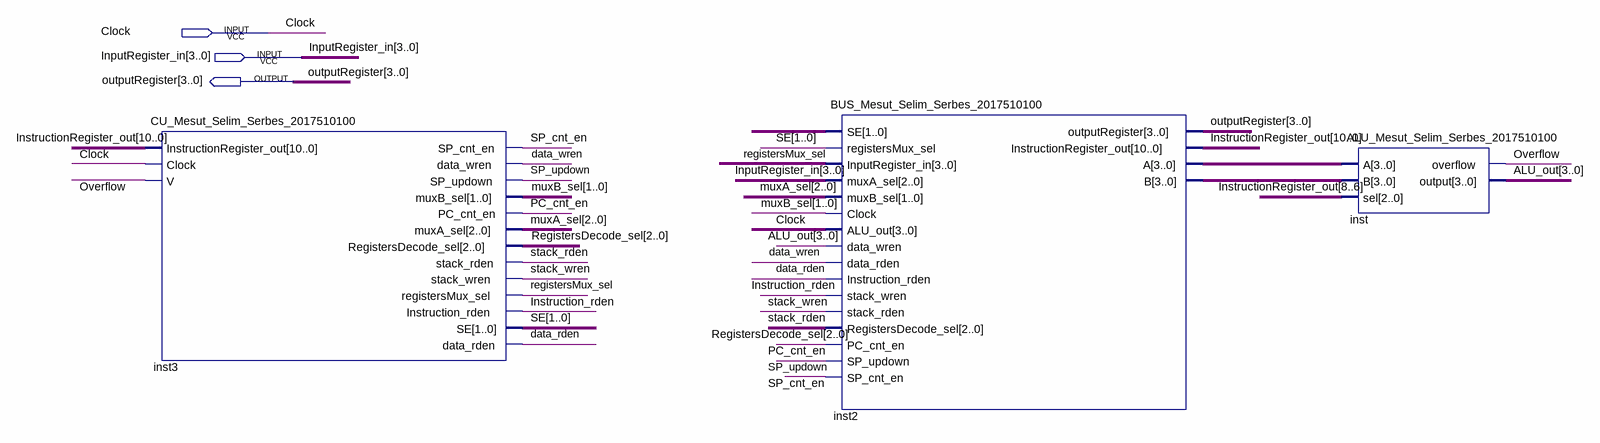
[diagram p0: schematic sheet]
// Quartus schematic DEUARC_Mesut_Selim_Serbes_2017510100.bdf as structural Verilog: 3 symbols, 3 pins
module DEUARC_Mesut_Selim_Serbes_2017510100 (
  input  Clock,
  input  [3:0] InputRegister_in,
  output [3:0] outputRegister
);

  wire data_rden, data_wren, Instruction_rden, Overflow, PC_cnt_en, registersMux_sel, SP_cnt_en, SP_updown,
       stack_rden, stack_wren;
  wire [1:0] muxB_sel, SE;
  wire [2:0] muxA_sel, RegistersDecode_sel;
  wire [3:0] ALU_out, inst2_a, inst2_b;
  wire [10:0] InstructionRegister_out;

  CU_Mesut_Selim_Serbes_2017510100 inst3 (
    .InstructionRegister_out(InstructionRegister_out), .Clock(Clock), .V(Overflow), .SP_cnt_en(SP_cnt_en),
    .data_wren(data_wren), .SP_updown(SP_updown), .muxB_sel(muxB_sel), .PC_cnt_en(PC_cnt_en),
    .muxA_sel(muxA_sel), .RegistersDecode_sel(RegistersDecode_sel), .stack_rden(stack_rden),
    .stack_wren(stack_wren), .registersMux_sel(registersMux_sel), .Instruction_rden(Instruction_rden),
    .SE(SE), .data_rden(data_rden));
  BUS_Mesut_Selim_Serbes_2017510100 inst2 (
    .SE(SE), .registersMux_sel(registersMux_sel), .InputRegister_in(InputRegister_in), .muxA_sel(muxA_sel),
    .muxB_sel(muxB_sel), .Clock(Clock), .ALU_out(ALU_out), .data_wren(data_wren), .data_rden(data_rden),
    .Instruction_rden(Instruction_rden), .stack_wren(stack_wren), .stack_rden(stack_rden),
    .RegistersDecode_sel(RegistersDecode_sel), .PC_cnt_en(PC_cnt_en), .SP_updown(SP_updown),
    .SP_cnt_en(SP_cnt_en), .outputRegister(outputRegister),
    .InstructionRegister_out(InstructionRegister_out), .A(inst2_a), .B(inst2_b));
  ALU_Mesut_Selim_Serbes_2017510100 inst (
    .A(inst2_a), .B(inst2_b), .sel(InstructionRegister_out[8:6]), .overflow(Overflow), .\output (ALU_out));
endmodule
